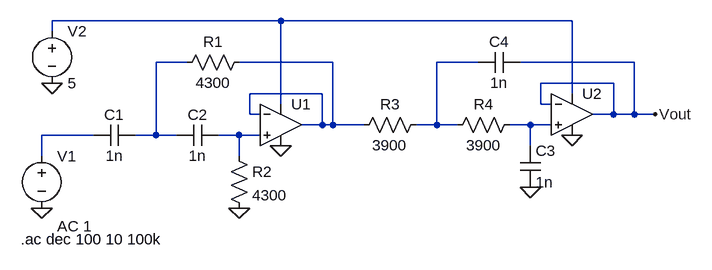
[diagram p0: schematic Sallen Key Filter.asc]
Sallen Key Filter.asc, the LTspice schematic file:
Version 4.1
SHEET 1 932 680
WIRE 272 -112 -80 -112
WIRE 720 -112 272 -112
WIRE -80 -96 -80 -112
WIRE 128 -48 80 -48
WIRE 352 -48 208 -48
WIRE 576 -48 512 -48
WIRE 816 -48 640 -48
WIRE 784 -16 672 -16
WIRE 336 0 224 0
WIRE 720 0 720 -112
WIRE 272 16 272 -112
WIRE 672 16 672 -16
WIRE 688 16 672 16
WIRE 224 32 224 0
WIRE 240 32 224 32
WIRE 784 32 784 -16
WIRE 784 32 752 32
WIRE 816 32 816 -48
WIRE 816 32 784 32
WIRE 848 32 816 32
WIRE 336 48 336 0
WIRE 336 48 304 48
WIRE 352 48 352 -48
WIRE 352 48 336 48
WIRE 400 48 352 48
WIRE 512 48 512 -48
WIRE 512 48 480 48
WIRE 544 48 512 48
WIRE 656 48 624 48
WIRE 688 48 656 48
WIRE -16 64 -96 64
WIRE 80 64 80 -48
WIRE 80 64 48 64
WIRE 112 64 80 64
WIRE 208 64 176 64
WIRE 240 64 208 64
WIRE 656 80 656 48
WIRE -96 96 -96 64
WIRE 208 96 208 64
FLAG -96 176 0
FLAG 208 176 0
FLAG 272 80 0
FLAG -80 -16 0
FLAG 656 144 0
FLAG 720 64 0
FLAG 848 32 Vout
SYMBOL voltage -96 80 R0
WINDOW 123 24 124 Left 2
WINDOW 39 0 0 Left 0
SYMATTR Value2 AC 1
SYMATTR InstName V1
SYMATTR Value ""
SYMBOL cap 48 48 R90
WINDOW 0 0 32 VBottom 2
WINDOW 3 32 32 VTop 2
SYMATTR InstName C1
SYMATTR Value 1n
SYMBOL cap 176 48 R90
WINDOW 0 0 32 VBottom 2
WINDOW 3 32 32 VTop 2
SYMATTR InstName C2
SYMATTR Value 1n
SYMBOL OpAmps\\UniversalOpAmp 272 48 R0
SYMATTR InstName U1
SYMBOL res 192 80 R0
SYMATTR InstName R2
SYMATTR Value 4300
SYMBOL res 224 -64 R90
WINDOW 0 0 56 VBottom 2
WINDOW 3 32 56 VTop 2
SYMATTR InstName R1
SYMATTR Value 4300
SYMBOL voltage -80 -112 R0
SYMATTR InstName V2
SYMATTR Value 5
SYMBOL res 496 32 R90
WINDOW 0 0 56 VBottom 2
WINDOW 3 32 56 VTop 2
SYMATTR InstName R3
SYMATTR Value 3900
SYMBOL res 640 32 R90
WINDOW 0 0 56 VBottom 2
WINDOW 3 32 56 VTop 2
SYMATTR InstName R4
SYMATTR Value 3900
SYMBOL OpAmps\\UniversalOpAmp 720 32 R0
SYMATTR InstName U2
SYMBOL cap 640 80 R0
SYMATTR InstName C3
SYMATTR Value 1n
SYMBOL cap 640 -64 R90
WINDOW 0 0 32 VBottom 2
WINDOW 3 32 32 VTop 2
SYMATTR InstName C4
SYMATTR Value 1n
TEXT -128 224 Left 2 !.ac dec 100 10 100k

The netlist it stands for:
* Sallen Key Filter.asc
V1 N006 0 AC 1
C1 N002 N006 1n
C2 N007 N002 1n
X§U1 N007 N003 N001 0 N003 level1 Avol=1Meg GBW=10Meg Vos=0 En=0 Enk=0 In=0 Ink=0 Rin=500Meg  ; pins In+ In- V+ V- OUT
R2 N007 0 4300
R1 N003 N002 4300
V2 N001 0 5
R3 N004 N003 3900
R4 N005 N004 3900
X§U2 N005 Vout N001 0 Vout level1 Avol=1Meg GBW=10Meg Vos=0 En=0 Enk=0 In=0 Ink=0 Rin=500Meg  ; pins In+ In- V+ V- OUT
C3 N005 0 1n
C4 Vout N004 1n
.ac dec 100 10 100k
.lib UniversalOpAmp1.lib
.backanno
.end